# Altium schematic sheet μC-Core.SchDoc: Microcontroller & Pinout
size A4; Author: Lázár Sándor; SheetNumber: 3; SheetTotal: 6; URL: lzrsystems.com
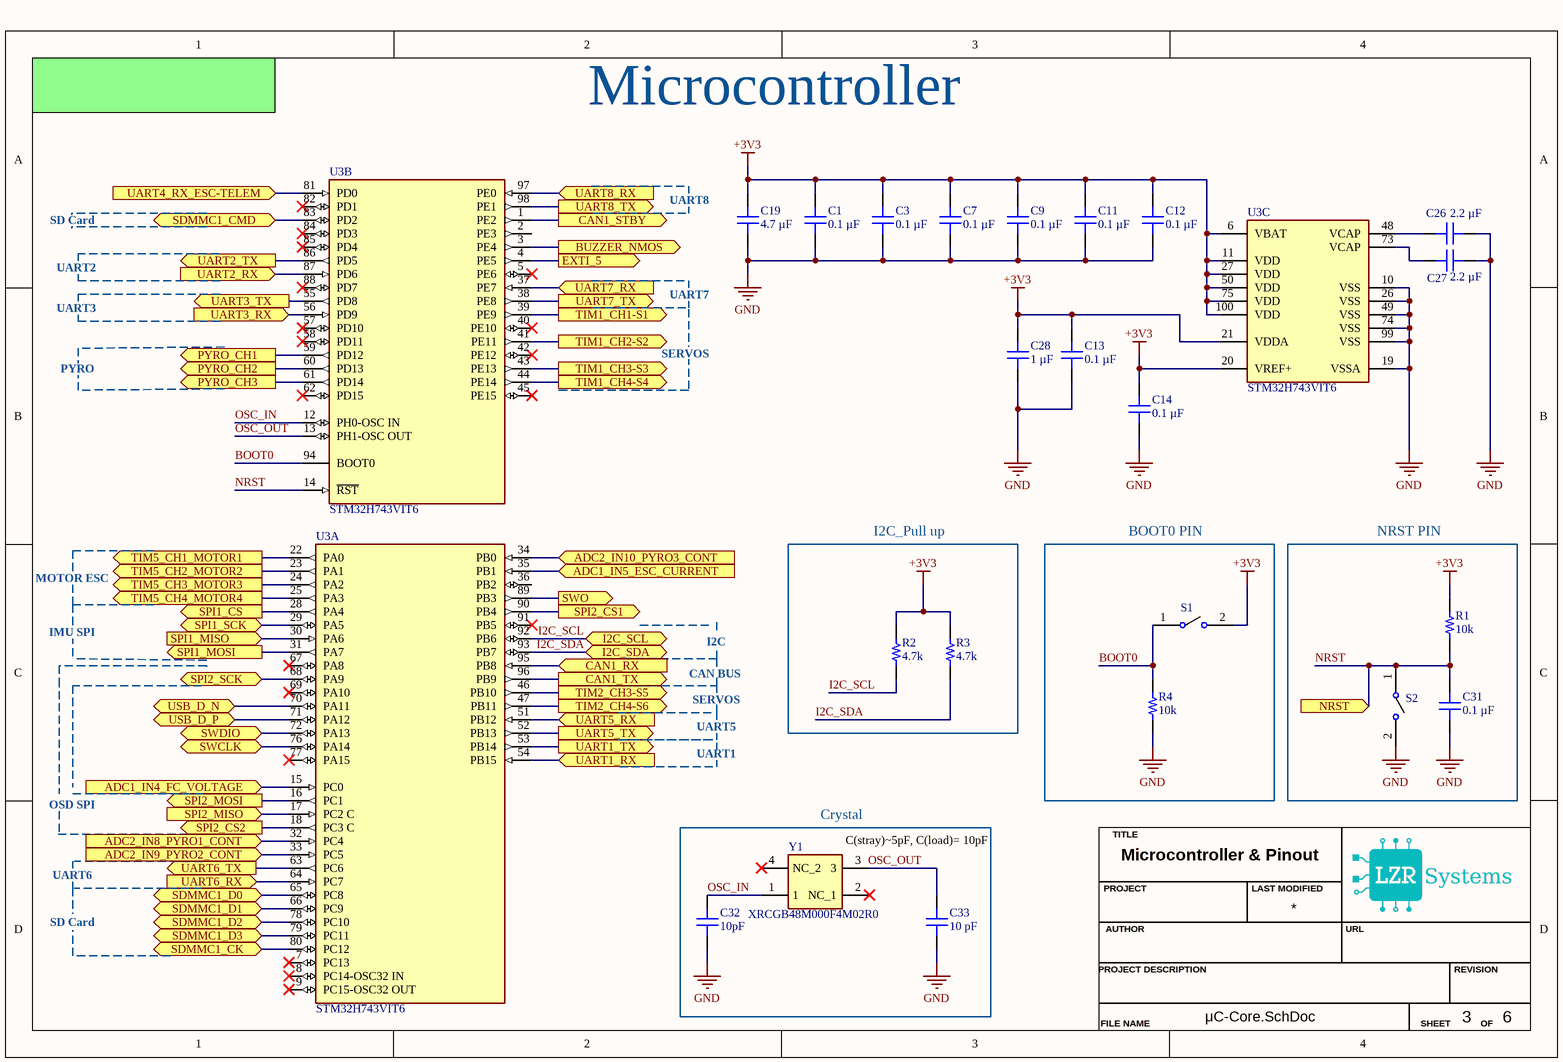
[diagram p0: μC-Core.SchDoc]

## Parts
C1  0.1 µF  [MURATA GCM155 0402_1005]
C3  0.1 µF  [MURATA GCM155 0402_1005]
C7  0.1 µF  [MURATA GCM155 0402_1005]
C9  0.1 µF  [MURATA GCM155 0402_1005]
C11  0.1 µF  [MURATA GCM155 0402_1005]
C12  0.1 µF  [MURATA GCM155 0402_1005]
C13  0.1 µF  [MURATA GCM155 0402_1005]
C14  0.1 µF  [MURATA GCM155 0402_1005]
C19  4.7 µF  [MURATA GRM21B 0805_2012]
C26  2.2 µF  [CAP 0805_2012]
C27  2.2 µF  [CAP 0805_2012]
C28  1 µF  [CAP 0805_2012]
C31  0.1 µF  [MURATA GCM155 0402_1005]
C32  Capacitance: 10pF  [CAP 0402_1005]  (hidden comment: 10 pF)
C33  10 pF  [CAP 0402_1005]
R1  10k  [YAGEO RES 0402_1005]
R2  4.7k  [YAGEO RES 0402_1005]
R3  4.7k  [YAGEO RES 0402_1005]
R4  10k  [YAGEO RES 0402_1005]
S1  TS09-63-25-WT-160-SMT-TR  [TS096325WT160SMTTR]  (value not drawn)
S2  TS09-63-25-WT-160-SMT-TR  [TS096325WT160SMTTR]  (value not drawn)
U3  STM32H743VIT6  [FP-LQFP100-1L-IPC_C]  (parts A,B,C of 3)
Y1  XRCGB48M000F4M02R0  [XRCGB]

## Blocks framed on the sheet
I2C_Pull up: R2 R3
BOOT0 PIN: R4 S1
NRST PIN: C31 R1 S2
Crystal: C32 C33 Y1

## Ports
ADC1_IN4_FC_VOLTAGE (in), ADC1_IN5_ESC_CURRENT (in), ADC2_IN8_PYRO1_CONT (in), ADC2_IN9_PYRO2_CONT (in), ADC2_IN10_PYRO3_CONT (in), BUZZER_NMOS (out), CAN1_RX (in), CAN1_STBY (out), CAN1_TX (out), EXTI_5 (out), I2C_SCL (bidir), I2C_SDA (bidir), NRST (in), PYRO_CH1 (out), PYRO_CH2 (out), PYRO_CH3 (out), SDMMC1_CK (bidir), SDMMC1_CMD (bidir), SDMMC1_D0 (bidir), SDMMC1_D1 (bidir), SDMMC1_D2 (bidir), SDMMC1_D3 (bidir), SPI1_CS (out), SPI1_MISO (in), SPI1_MOSI (out), SPI1_SCK (bidir), SPI2_CS1 (out), SPI2_CS2 (out), SPI2_MISO (in), SPI2_MOSI (out), SPI2_SCK (bidir), SWCLK (bidir), SWDIO (bidir), SWO (out), TIM1_CH1-S1 (out), TIM1_CH2-S2 (out), TIM1_CH3-S3 (out), TIM1_CH4-S4 (out), TIM2_CH3-S5 (out), TIM2_CH4-S6 (out), TIM5_CH1_MOTOR1 (out), TIM5_CH2_MOTOR2 (out), TIM5_CH3_MOTOR3 (out), TIM5_CH4_MOTOR4 (out), UART1_RX (in), UART1_TX (out), UART2_RX (in), UART2_TX (out), UART3_RX (in), UART3_TX (out), UART4_RX_ESC-TELEM (in), UART5_RX (in), UART5_TX (out), UART6_RX (in), UART6_TX (out), UART7_RX (in), UART7_TX (out), UART8_RX (in), UART8_TX (out), USB_D_N (bidir), USB_D_P (bidir)

## Nets
+3V3: C1.2 C3.2 C7.2 C9.2 C11.2 C12.2 C13.2 C14.2 C19.2 C28.2 R1.1 R2.2 R3.2 S1.2(NO) U3.6(VBAT) U3.11(VDD) U3.20(VREF+) U3.21(VDDA) U3.27(VDD) U3.50(VDD) U3.75(VDD) U3.100(VDD)
GND: C1.1 C3.1 C7.1 C9.1 C11.1 C12.1 C13.1 C14.1 C19.1 C26.2 C27.1 C28.1 C31.1 C32.1 C33.1 R4.2 S2.2(NO) U3.10(VSS) U3.19(VSSA) U3.26(VSS) U3.49(VSS) U3.74(VSS) U3.99(VSS)
ADC1_IN4_FC_VOLTAGE: U3.15(PC0) ; port ADC1_IN4_FC_VOLTAGE
ADC1_IN5_ESC_CURRENT: U3.35(PB1) ; port ADC1_IN5_ESC_CURRENT
ADC2_IN8_PYRO1_CONT: U3.32(PC4) ; port ADC2_IN8_PYRO1_CONT
ADC2_IN9_PYRO2_CONT: U3.33(PC5) ; port ADC2_IN9_PYRO2_CONT
ADC2_IN10_PYRO3_CONT: U3.34(PB0) ; port ADC2_IN10_PYRO3_CONT
BOOT0: R4.1 S1.1(COM) U3.94(BOOT0)
BUZZER_NMOS: U3.3(PE4) ; port BUZZER_NMOS
CAN1_RX: U3.95(PB8) ; port CAN1_RX
CAN1_STBY: U3.1(PE2) ; port CAN1_STBY
CAN1_TX: U3.96(PB9) ; port CAN1_TX
EXTI_5: U3.4(PE5) ; port EXTI_5
I2C_SCL: R2.1 U3.92(PB6) ; port I2C_SCL
I2C_SDA: R3.1 U3.93(PB7) ; port I2C_SDA
NRST: C31.2 R1.2 S2.1(COM) U3.14(~{RST}) ; port NRST
OSC_IN: C32.2 U3.12(PH0-OSC_IN) Y1.1
OSC_OUT: C33.2 U3.13(PH1-OSC_OUT) Y1.3
PYRO_CH1: U3.59(PD12) ; port PYRO_CH1
PYRO_CH2: U3.60(PD13) ; port PYRO_CH2
PYRO_CH3: U3.61(PD14) ; port PYRO_CH3
SDMMC1_CK: U3.80(PC12) ; port SDMMC1_CK
SDMMC1_CMD: U3.83(PD2) ; port SDMMC1_CMD
SDMMC1_D0: U3.65(PC8) ; port SDMMC1_D0
SDMMC1_D1: U3.66(PC9) ; port SDMMC1_D1
SDMMC1_D2: U3.78(PC10) ; port SDMMC1_D2
SDMMC1_D3: U3.79(PC11) ; port SDMMC1_D3
SPI1_CS: U3.28(PA4) ; port SPI1_CS
SPI1_MISO: U3.30(PA6) ; port SPI1_MISO
SPI1_MOSI: U3.31(PA7) ; port SPI1_MOSI
SPI1_SCK: U3.29(PA5) ; port SPI1_SCK
SPI2_CS1: U3.90(PB4) ; port SPI2_CS1
SPI2_CS2: U3.18(PC3_C) ; port SPI2_CS2
SPI2_MISO: U3.17(PC2_C) ; port SPI2_MISO
SPI2_MOSI: U3.16(PC1) ; port SPI2_MOSI
SPI2_SCK: U3.68(PA9) ; port SPI2_SCK
SWCLK: U3.76(PA14) ; port SWCLK
SWDIO: U3.72(PA13) ; port SWDIO
SWO: U3.89(PB3) ; port SWO
TIM1_CH1-S1: U3.39(PE9) ; port TIM1_CH1-S1
TIM1_CH2-S2: U3.41(PE11) ; port TIM1_CH2-S2
TIM1_CH3-S3: U3.43(PE13) ; port TIM1_CH3-S3
TIM1_CH4-S4: U3.44(PE14) ; port TIM1_CH4-S4
TIM2_CH3-S5: U3.46(PB10) ; port TIM2_CH3-S5
TIM2_CH4-S6: U3.47(PB11) ; port TIM2_CH4-S6
TIM5_CH1_MOTOR1: U3.22(PA0) ; port TIM5_CH1_MOTOR1
TIM5_CH2_MOTOR2: U3.23(PA1) ; port TIM5_CH2_MOTOR2
TIM5_CH3_MOTOR3: U3.24(PA2) ; port TIM5_CH3_MOTOR3
TIM5_CH4_MOTOR4: U3.25(PA3) ; port TIM5_CH4_MOTOR4
UART1_RX: U3.54(PB15) ; port UART1_RX
UART1_TX: U3.53(PB14) ; port UART1_TX
UART2_RX: U3.87(PD6) ; port UART2_RX
UART2_TX: U3.86(PD5) ; port UART2_TX
UART3_RX: U3.56(PD9) ; port UART3_RX
UART3_TX: U3.55(PD8) ; port UART3_TX
UART4_RX_ESC-TELEM: U3.81(PD0) ; port UART4_RX_ESC-TELEM
UART5_RX: U3.51(PB12) ; port UART5_RX
UART5_TX: U3.52(PB13) ; port UART5_TX
UART6_RX: U3.64(PC7) ; port UART6_RX
UART6_TX: U3.63(PC6) ; port UART6_TX
UART7_RX: U3.37(PE7) ; port UART7_RX
UART7_TX: U3.38(PE8) ; port UART7_TX
UART8_RX: U3.97(PE0) ; port UART8_RX
UART8_TX: U3.98(PE1) ; port UART8_TX
USB_D_N: U3.70(PA11) ; port USB_D_N
USB_D_P: U3.71(PA12) ; port USB_D_P
NetC26_1: C26.1 U3.48(VCAP)
NetC27_2: C27.2 U3.73(VCAP)

Not connected (* = marked no-connect by the designer): U3 2(PE3) 5(PE6)* 7(PC13)* 8(PC14-OSC32_IN)* 9(PC15-OSC32_OUT)* 36(PB2) 40(PE10)* 42(PE12)* 45(PE15)* 57(PD10)* 58(PD11)* 62(PD15)* 67(PA8)* 69(PA10)* 77(PA15)* 82(PD1)* 84(PD3)* 85(PD4)* 88(PD7)* 91(PB5)*; Y1 2(NC_1)* 4(NC_2)*

## Notes on the sheet
- Microcontroller
- (near C19) UART8
- SD Card
- UART2
- UART3
- UART7
- PYRO
- SERVOS
- MOTOR ESC
- IMU SPI
- CAN BUS
- I2C
- UART5
- OSD SPI
- UART1
- UART6
- (near Y1) C(stray)~5pF, C(load)= 10pF
- TITLE
- AUTHOR
- PROJECT
- LAST MODIFIED
- URL
- PROJECT DESCRIPTION
- REVISION
- FILE NAME
- SHEET
- OF

## Library data of the parts
C1 C3 C7 C9 C11-C14 C31 = GCM155R71H104ME02D: CAP CER 0.1UF 50V X7R 0402; manufacturer: Murata Electronics; Tolerance: ±20%; Part Number: GCM155R71H104ME02D; Capacitance: 0.1 µF; Applications: Automotive; componentlink1description: Datasheet; componentlink1url: https://psearch.en.murata.com/capacitor/product/GCM155R71H104ME02%23.pdf; componentlink2description: DigiKey Link; componentlink2url: https://www.digikey.com/en/products/detail/murata-electronics/GCM155R71H104ME02D/9867913; Device Package: 0402 (1005 Metric); lastupdated: 7/20/2024 2:04:19 AM; Lifecycle Status: Active; Minimum Order: 1; Mounting Type: Surface Mount, MLCC; Operating Temperature: -55°C ~ 125°C; Package / Case: 0402 (1005 Metric); packaging: TapeAndReel; partid: 39038; Part Status: Active; price: 0.01; Ratings: AEC-Q200; series: GCM; Size / Dimension: 0.039" L x 0.020" W (1.00mm x 0.50mm); Supplier 1: DigiKey; Supplier Part Number 1: 490-18204-1-ND; Temperature Coefficient: X7R; Thickness (Max): 0.022" (0.55mm); value: 0.1 µF; Voltage - Rated: 50V
C19 = GRM21BR61H475KE51L: CAP CER 4.7UF 50V X5R 0805; manufacturer: Murata Electronics; Tolerance: ±10%; Part Number: GRM21BR61H475KE51L; Capacitance: 4.7 µF; Applications: General Purpose; componentlink1description: Datasheet; componentlink1url: https://search.murata.co.jp/Ceramy/image/img/A01X/G101/ENG/GRM21BR61H475KE51-01.pdf; componentlink2description: DigiKey Link; componentlink2url: https://www.digikey.com/en/products/detail/murata-electronics/GRM21BR61H475KE51L/4905540; Device Package: 0805 (2012 Metric); lastupdated: 8/27/2024 9:29:55 AM; Lifecycle Status: Active; Minimum Order: 1; Mounting Type: Surface Mount, MLCC; Operating Temperature: -55°C ~ 85°C; Package / Case: 0805 (2012 Metric); packaging: TapeAndReel; partid: 15077; Part Status: Active; price: 0.03; series: GRM; Size / Dimension: 0.079" L x 0.049" W (2.00mm x 1.25mm); Supplier 1: DigiKey; Supplier Part Number 1: 490-10751-1-ND; Temperature Coefficient: X5R; Thickness (Max): 0.055" (1.40mm); value: 4.7 µF; Voltage - Rated: 50V
C26 C27 = GCM21BL8EG225KE07L: CAP CER 2.2UF 35V X8L 0805; manufacturer: Murata Electronics; Tolerance: ±10%; Part Number: GCM21BL8EG225KE07L; Capacitance: 2.2 µF; Applications: Automotive; componentlink2description: DigiKey Link; componentlink2url: https://www.digikey.com/en/products/detail/murata-electronics/GCM21BL8EG225KE07L/10700975; Device Package: 0805 (2012 Metric); lastupdated: 2/9/2024 8:15:05 PM; Lifecycle Status: Active; Minimum Order: 1; Mounting Type: Surface Mount, MLCC; Operating Temperature: -55°C ~ 150°C; Package / Case: 0805 (2012 Metric); packaging: TapeAndReel; partid: 40665; Part Status: Active; price: 0.10; Ratings: AEC-Q200; series: GCM; Size / Dimension: 0.079" L x 0.049" W (2.00mm x 1.25mm); Supplier 1: DigiKey; Supplier Part Number 1: 490-GCM21BL8EG225KE07LCT-ND; Temperature Coefficient: X8L; Thickness (Max): 0.055" (1.40mm); value: 2.2 µF; Voltage - Rated: 35V
C28 = GRM219R7YA105MA12D: CAP CER 1UF 35V X7R 0805; manufacturer: Murata Electronics; Tolerance: ±20%; Part Number: GRM219R7YA105MA12D; Capacitance: 1 µF; Applications: General Purpose; componentlink1description: Datasheet; componentlink1url: https://search.murata.co.jp/Ceramy/image/img/A01X/G101/ENG/GRM219R7YA105MA12-01.pdf; componentlink2description: DigiKey Link; componentlink2url: https://www.digikey.com/en/products/detail/murata-electronics/GRM219R7YA105MA12D/5027580; Device Package: 0805 (2012 Metric); lastupdated: 2/9/2024 8:15:57 PM; Lifecycle Status: Active; Minimum Order: 1; Mounting Type: Surface Mount, MLCC; Operating Temperature: -55°C ~ 125°C; Package / Case: 0805 (2012 Metric); packaging: TapeAndReel; partid: 6744; Part Status: Active; price: 0.02; series: GRM; Size / Dimension: 0.079" L x 0.049" W (2.00mm x 1.25mm); Supplier 1: DigiKey; Supplier Part Number 1: 490-10495-1-ND; Temperature Coefficient: X7R; Thickness (Max): 0.037" (0.95mm); value: 1 µF; Voltage - Rated: 35V
C32 C33 = C0402C100K4GAC7867: CAP CER 10PF 16V C0G/NP0 0402; manufacturer: KEMET; Temperature Coefficient: C0G, NP0; Tolerance: ±10%; Part Number: C0402C100K4GAC7867; Applications: General Purpose; componentlink1description: Datasheet; componentlink1url: https://api.kemet.com/component-edge/download/datasheet/C0402C100K4GACTU.pdf; componentlink2description: DigiKey Link; componentlink2url: https://www.digikey.com/en/products/detail/kemet/C0402C100K4GAC7867/2196156; Device Package: 0402 (1005 Metric); Features: Low ESL; lastupdated: 2/9/2024 8:04:15 PM; Lifecycle Status: Active; Minimum Order: 1; Mounting Type: Surface Mount, MLCC; Operating Temperature: -55°C ~ 125°C; Package / Case: 0402 (1005 Metric); packaging: TapeAndReel; partid: 33741; Part Status: Active; price: 0.05; series: SMD Comm C0G; Size / Dimension: 0.039" L x 0.020" W (1.00mm x 0.50mm); Supplier 1: DigiKey; Supplier Part Number 1: 399-C0402C100K4GAC7867CT-ND; Thickness (Max): 0.022" (0.55mm); value: 10 pF; Voltage - Rated: 16V
  C33: Capacitance: 10 pF
R1 R4 = AC0402DR-0710KL: RES 10K OHM 0.5% 1/16W 0402; Manufacturer: Yageo; Power (Watts): 0.063W, 1/16W; Resistance: 10 kOhms; Temperature Coefficient: ±100ppm/°C; Part Number: AC0402DR-0710KL; Value: 10k; ComponentLink1Description: Datasheet; ComponentLink1URL: https://www.yageo.com/upload/media/product/productsearch/datasheet/rchip/PYu-AC_51_RoHS_L_9.pdf; ComponentLink2Description: DigiKey Link; ComponentLink2URL: https://www.digikey.com/en/products/detail/yageo/AC0402DR-0710KL/16990352; Composition: Thick Film; Device Package: 0402 (1005 Metric); Features: Automotive AEC-Q200, Moisture Resistant; Height - Seated (Max): 0.015" (0.37mm); LastUpdated: 8/31/2025 3:03:41 PM; Lifecycle Status: Active; Minimum Order: 1; Number of Terminations: 2; Operating Temperature: -55°C ~ 155°C; Package / Case: 0402 (1005 Metric); Packaging: TapeAndReel; PartId: 77661; Part Status: Active; Price: 0.01; Ratings: AEC-Q200; Series: AC; Size / Dimension: 0.039" L x 0.020" W (1.00mm x 0.50mm); Supplier 1: DigiKey; Supplier Part Number 1: 13-AC0402DR-0710KLCT-ND; Supplier Device Package: 0402; Tolerance: ±0.5%
R2 R3 = AC0402FR-134K7L: RES 4.7K OHM 1% 1/16W 0402; Manufacturer: Yageo; Power (Watts): 0.063W, 1/16W; Resistance: 4.7 kOhms; Temperature Coefficient: ±100ppm/°C; Part Number: AC0402FR-134K7L; Value: 4.7k; ComponentLink1Description: Datasheet; ComponentLink1URL: https://www.yageo.com/upload/media/product/productsearch/datasheet/rchip/PYu-AC_51_RoHS_L_8.pdf; ComponentLink2Description: DigiKey Link; ComponentLink2URL: https://www.digikey.com/en/products/detail/yageo/AC0402FR-134K7L/14008367; Composition: Thick Film; Device Package: 0402 (1005 Metric); Height - Seated (Max): 0.015" (0.37mm); LastUpdated: 8/31/2025 3:03:54 PM; Lifecycle Status: Active; Minimum Order: 1; Number of Terminations: 2; Operating Temperature: -55°C ~ 155°C; Package / Case: 0402 (1005 Metric); Packaging: CutTape; PartId: 65258; Part Status: Active; Price: 0.01; Ratings: AEC-Q200; Series: AC; Size / Dimension: 0.039" L x 0.020" W (1.00mm x 0.50mm); Supplier 1: DigiKey; Supplier Part Number 1: 13-AC0402FR-134K7LCT-ND; Supplier Device Package: 0402; Tolerance: ±1%
S1 S2 = TS09-63-25-WT-160-SMT-TR: Switch; Manufacturer_Name: Same Sky; Datasheet Link: https://www.sameskydevices.com/product/resource/ts09.pdf; Height: 2.7mm; Manufacturer_Part_Number: TS09-63-25-WT-160-SMT-TR; Mouser Part Number: 179-TS0925WT160SMTTR; Mouser Price/Stock: https://www.mouser.co.uk/ProductDetail/CUI-Devices/TS09-63-25-WT-160-SMT-TR?qs=Rp5uXu7WBW%2F4oc%2FgdKTFnw%3D%3D
U3 = CMP-020-00029-1: RISC Microcontroller, 32-Bit, FLASH, CORTEX-M7 CPU, 480MHz, CMOS, PQFP100; Min Supply Voltage: 1.71V; Max Supply Voltage: 3.6V; Interface: Ethernet, I2C, I2S, IrDA, LIN, SPI, UART, USART, USB; RAM Size: 1MB; Max Operating Temperature: 85°C; Min Operating Temperature: -40°C; Frequency: 480MHz
Y1 = XRCGB48M000F4M00R0: Crystal or Oscillator; Manufacturer_Name: Murata Electronics; Datasheet Link: https://www.murata.com/products/productdata/8801067466782/SPEC-XRCGB48M000F4M00R0.pdf; Height: 0.7mm; Manufacturer_Part_Number: XRCGB48M000F4M00R0; Mouser Part Number: 81-XRCGB48M000F4M0R0; Mouser Price/Stock: https://www.mouser.co.uk/ProductDetail/Murata-Electronics/XRCGB48M000F4M00R0?qs=e%252BE4OD6MgMd07skQ7eZ%2F7Q%3D%3D; Arrow Part Number: XRCGB48M000F4M00R0; Arrow Price/Stock: https://www.arrow.com/en/products/xrcgb48m000f4m00r0/murata-manufacturing